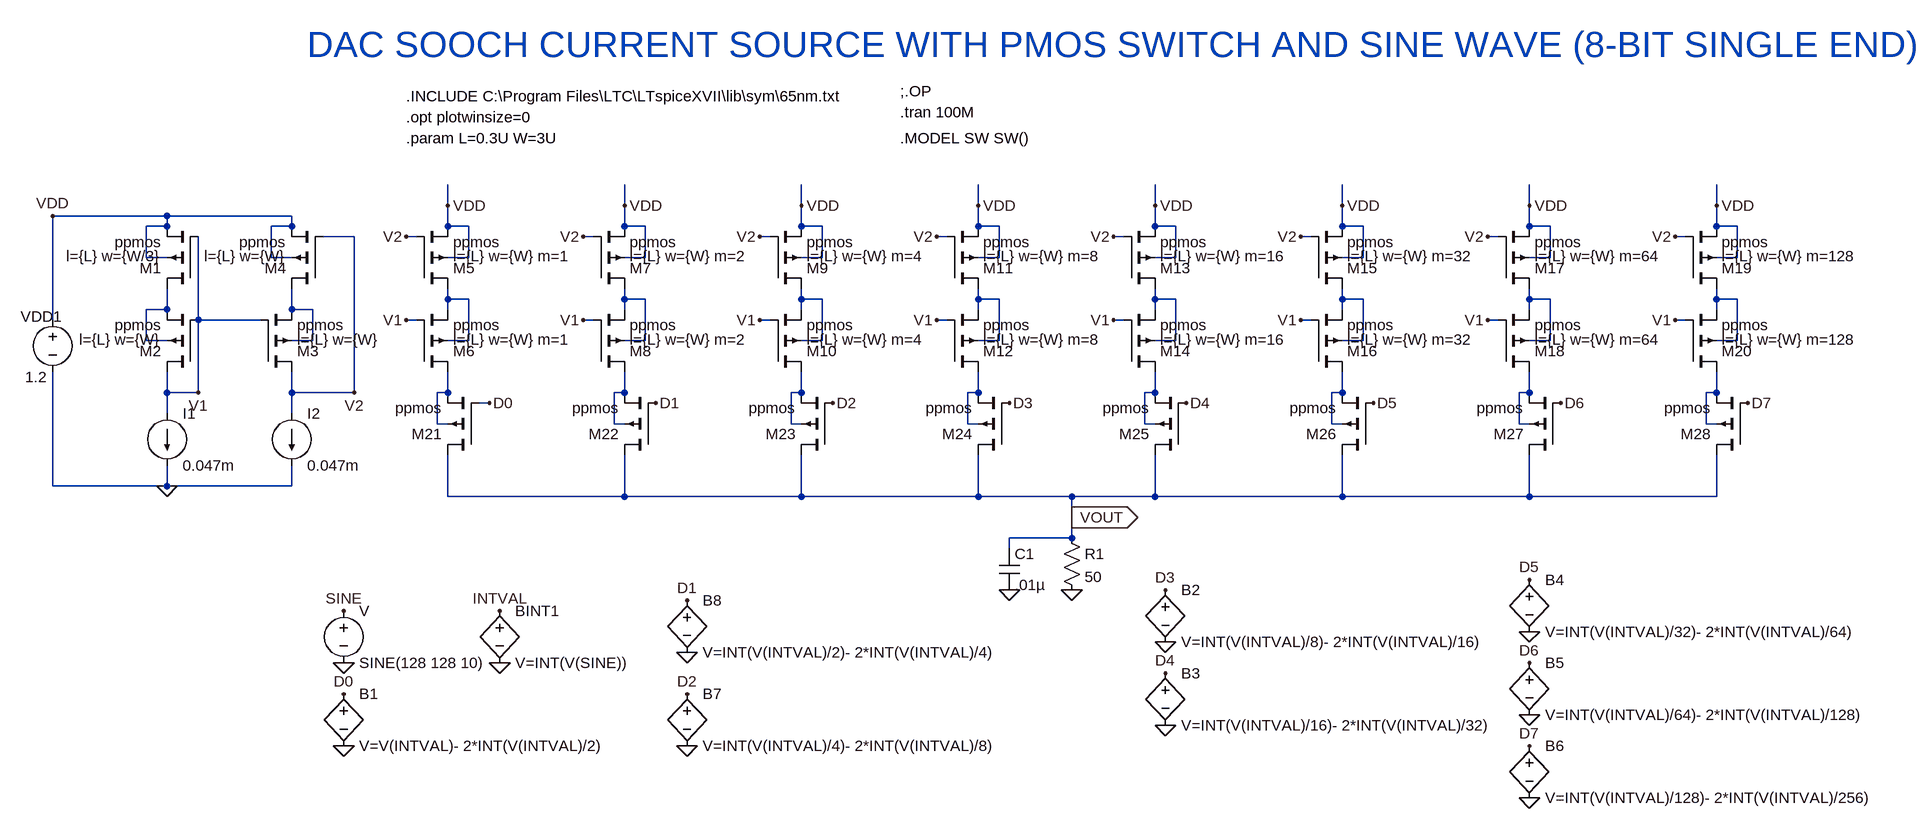
[diagram p0: schematic 108DAC_SINGLE_END_SOOCH_PMOS_SW_SINE_8BIT.asc]
108DAC_SINGLE_END_SOOCH_PMOS_SW_SINE_8BIT.asc, the LTspice schematic file:
Version 4
SHEET 1 1572 880
WIRE -592 -208 -592 -240
WIRE -320 -208 -320 -240
WIRE -48 -208 -48 -240
WIRE 224 -208 224 -240
WIRE 496 -208 496 -240
WIRE 784 -208 784 -240
WIRE 1072 -208 1072 -240
WIRE 1360 -208 1360 -240
WIRE -1024 -192 -1200 -192
WIRE -832 -192 -1024 -192
WIRE -1024 -176 -1024 -192
WIRE -1024 -176 -1056 -176
WIRE -832 -176 -832 -192
WIRE -832 -176 -864 -176
WIRE -592 -176 -592 -208
WIRE -560 -176 -592 -176
WIRE -320 -176 -320 -208
WIRE -288 -176 -320 -176
WIRE -48 -176 -48 -208
WIRE -16 -176 -48 -176
WIRE 224 -176 224 -208
WIRE 256 -176 224 -176
WIRE 496 -176 496 -208
WIRE 528 -176 496 -176
WIRE 784 -176 784 -208
WIRE 816 -176 784 -176
WIRE 1072 -176 1072 -208
WIRE 1104 -176 1072 -176
WIRE 1360 -176 1360 -208
WIRE 1392 -176 1360 -176
WIRE -736 -160 -784 -160
WIRE -640 -160 -656 -160
WIRE -368 -160 -384 -160
WIRE -96 -160 -112 -160
WIRE 176 -160 160 -160
WIRE 448 -160 432 -160
WIRE 736 -160 720 -160
WIRE 1024 -160 1008 -160
WIRE 1312 -160 1296 -160
WIRE -1056 -128 -1056 -176
WIRE -1024 -128 -1056 -128
WIRE -864 -128 -864 -176
WIRE -832 -128 -864 -128
WIRE -560 -128 -560 -176
WIRE -560 -128 -592 -128
WIRE -288 -128 -288 -176
WIRE -288 -128 -320 -128
WIRE -16 -128 -16 -176
WIRE -16 -128 -48 -128
WIRE 256 -128 256 -176
WIRE 256 -128 224 -128
WIRE 528 -128 528 -176
WIRE 528 -128 496 -128
WIRE 816 -128 816 -176
WIRE 816 -128 784 -128
WIRE 1104 -128 1104 -176
WIRE 1104 -128 1072 -128
WIRE 1392 -128 1392 -176
WIRE 1392 -128 1360 -128
WIRE -592 -64 -592 -80
WIRE -560 -64 -592 -64
WIRE -320 -64 -320 -80
WIRE -288 -64 -320 -64
WIRE -48 -64 -48 -80
WIRE -16 -64 -48 -64
WIRE 224 -64 224 -80
WIRE 256 -64 224 -64
WIRE 496 -64 496 -80
WIRE 528 -64 496 -64
WIRE 784 -64 784 -80
WIRE 816 -64 784 -64
WIRE 1072 -64 1072 -80
WIRE 1104 -64 1072 -64
WIRE 1360 -64 1360 -80
WIRE 1392 -64 1360 -64
WIRE -1024 -48 -1024 -80
WIRE -1024 -48 -1056 -48
WIRE -832 -48 -832 -80
WIRE -800 -48 -832 -48
WIRE -592 -48 -592 -64
WIRE -320 -48 -320 -64
WIRE -48 -48 -48 -64
WIRE 224 -48 224 -64
WIRE 496 -48 496 -64
WIRE 784 -48 784 -64
WIRE 1072 -48 1072 -64
WIRE 1360 -48 1360 -64
WIRE -1200 -32 -1200 -192
WIRE -976 -32 -976 -160
WIRE -880 -32 -976 -32
WIRE -640 -32 -656 -32
WIRE -368 -32 -384 -32
WIRE -96 -32 -112 -32
WIRE 176 -32 160 -32
WIRE 448 -32 432 -32
WIRE 736 -32 720 -32
WIRE 1024 -32 1008 -32
WIRE 1312 -32 1296 -32
WIRE -1056 0 -1056 -48
WIRE -1024 0 -1056 0
WIRE -800 0 -800 -48
WIRE -800 0 -832 0
WIRE -560 0 -560 -64
WIRE -560 0 -592 0
WIRE -288 0 -288 -64
WIRE -288 0 -320 0
WIRE -16 0 -16 -64
WIRE -16 0 -48 0
WIRE 256 0 256 -64
WIRE 256 0 224 0
WIRE 528 0 528 -64
WIRE 528 0 496 0
WIRE 816 0 816 -64
WIRE 816 0 784 0
WIRE 1104 0 1104 -64
WIRE 1104 0 1072 0
WIRE 1392 0 1392 -64
WIRE 1392 0 1360 0
WIRE -1024 80 -1024 48
WIRE -976 80 -976 -32
WIRE -976 80 -1024 80
WIRE -832 80 -832 48
WIRE -736 80 -736 -160
WIRE -736 80 -832 80
WIRE -592 80 -592 48
WIRE -592 80 -608 80
WIRE -320 80 -320 48
WIRE -320 80 -336 80
WIRE -48 80 -48 48
WIRE -48 80 -64 80
WIRE 224 80 224 48
WIRE 224 80 208 80
WIRE 496 80 496 48
WIRE 496 80 480 80
WIRE 784 80 784 48
WIRE 784 80 768 80
WIRE 1072 80 1072 48
WIRE 1072 80 1056 80
WIRE 1360 80 1360 48
WIRE 1360 80 1344 80
WIRE -528 96 -544 96
WIRE -1024 112 -1024 80
WIRE -832 112 -832 80
WIRE -608 128 -608 80
WIRE -592 128 -608 128
WIRE -336 128 -336 80
WIRE -320 128 -336 128
WIRE -64 128 -64 80
WIRE -48 128 -64 128
WIRE 208 128 208 80
WIRE 224 128 208 128
WIRE 480 128 480 80
WIRE 496 128 480 128
WIRE 768 128 768 80
WIRE 784 128 768 128
WIRE 1056 128 1056 80
WIRE 1072 128 1056 128
WIRE 1344 128 1344 80
WIRE 1360 128 1344 128
WIRE -1200 224 -1200 48
WIRE -1024 224 -1024 192
WIRE -1024 224 -1200 224
WIRE -832 224 -832 192
WIRE -832 224 -1024 224
WIRE -592 240 -592 176
WIRE -320 240 -320 176
WIRE -320 240 -592 240
WIRE -48 240 -48 176
WIRE -48 240 -320 240
WIRE 224 240 224 176
WIRE 224 240 -48 240
WIRE 368 240 224 240
WIRE 496 240 496 176
WIRE 496 240 368 240
WIRE 784 240 784 176
WIRE 784 240 496 240
WIRE 1072 240 1072 176
WIRE 1072 240 784 240
WIRE 1360 240 1360 176
WIRE 1360 240 1072 240
WIRE 368 272 368 240
WIRE 368 304 368 272
WIRE 368 304 272 304
WIRE 272 320 272 304
FLAG -976 80 V1
FLAG -656 -32 V1
FLAG -736 80 V2
FLAG -656 -160 V2
FLAG -592 -208 VDD
FLAG -1200 -192 VDD
FLAG -384 -32 V1
FLAG -384 -160 V2
FLAG -320 -208 VDD
FLAG -112 -32 V1
FLAG -112 -160 V2
FLAG -48 -208 VDD
FLAG 160 -32 V1
FLAG 160 -160 V2
FLAG 224 -208 VDD
FLAG 432 -32 V1
FLAG 432 -160 V2
FLAG 496 -208 VDD
FLAG 720 -32 V1
FLAG 720 -160 V2
FLAG 784 -208 VDD
FLAG 1008 -32 V1
FLAG 1008 -160 V2
FLAG 1072 -208 VDD
FLAG 1296 -32 V1
FLAG 1296 -160 V2
FLAG 1360 -208 VDD
FLAG 368 384 0
FLAG -1024 224 0
FLAG 368 272 VOUT
IOPIN 368 272 Out
FLAG 272 384 0
FLAG -752 496 0
FLAG -752 416 SINE
FLAG -512 496 0
FLAG -512 416 INTVAL
FLAG -752 544 D0
FLAG -752 624 0
FLAG -224 400 D1
FLAG -224 544 D2
FLAG 512 384 D3
FLAG 512 512 D4
FLAG 1072 368 D5
FLAG 1072 496 D6
FLAG 1072 624 D7
FLAG 512 464 0
FLAG 512 592 0
FLAG 1072 448 0
FLAG 1072 576 0
FLAG 1072 704 0
FLAG -224 624 0
FLAG -224 480 0
FLAG -272 96 D1
FLAG 0 96 D2
FLAG 272 96 D3
FLAG 544 96 D4
FLAG 832 96 D5
FLAG 1120 96 D6
FLAG 1408 96 D7
FLAG -528 96 D0
SYMBOL pmos4 -976 -80 R180
WINDOW 123 56 50 Left 2
SYMATTR Value2 l={L} w={W/3}
SYMATTR InstName M1
SYMATTR Value ppmos
SYMBOL pmos4 -976 48 R180
WINDOW 123 56 50 Left 2
SYMATTR Value2 l={L} w={W}
SYMATTR InstName M2
SYMATTR Value ppmos
SYMBOL current -1024 112 R0
WINDOW 123 0 0 Left 0
WINDOW 39 0 0 Left 0
SYMATTR InstName I1
SYMATTR Value 0.047m
SYMBOL pmos4 -880 48 M180
WINDOW 123 56 50 Left 2
SYMATTR Value2 l={L} w={W}
SYMATTR InstName M3
SYMATTR Value ppmos
SYMBOL pmos4 -784 -80 R180
WINDOW 123 56 50 Left 2
SYMATTR Value2 l={L} w={W}
SYMATTR InstName M4
SYMATTR Value ppmos
SYMBOL current -832 112 R0
WINDOW 123 0 0 Left 0
WINDOW 39 0 0 Left 0
SYMATTR InstName I2
SYMATTR Value 0.047m
SYMBOL pmos4 -640 -80 M180
WINDOW 123 56 50 Left 2
SYMATTR Value2 l={L} w={W} m=1
SYMATTR InstName M5
SYMATTR Value ppmos
SYMBOL pmos4 -640 48 M180
WINDOW 123 56 50 Left 2
SYMATTR Value2 l={L} w={W} m=1
SYMATTR InstName M6
SYMATTR Value ppmos
SYMBOL voltage -1200 -48 R0
WINDOW 123 0 0 Left 0
WINDOW 39 0 0 Left 0
WINDOW 0 -49 11 Left 2
WINDOW 3 -42 104 Left 2
SYMATTR InstName VDD1
SYMATTR Value 1.2
SYMBOL pmos4 -368 -80 M180
WINDOW 123 56 50 Left 2
SYMATTR Value2 l={L} w={W} m=2
SYMATTR InstName M7
SYMATTR Value ppmos
SYMBOL pmos4 -368 48 M180
WINDOW 123 56 50 Left 2
SYMATTR Value2 l={L} w={W} m=2
SYMATTR InstName M8
SYMATTR Value ppmos
SYMBOL pmos4 -96 -80 M180
WINDOW 123 56 50 Left 2
SYMATTR Value2 l={L} w={W} m=4
SYMATTR InstName M9
SYMATTR Value ppmos
SYMBOL pmos4 -96 48 M180
WINDOW 123 56 50 Left 2
SYMATTR Value2 l={L} w={W} m=4
SYMATTR InstName M10
SYMATTR Value ppmos
SYMBOL pmos4 176 -80 M180
WINDOW 123 56 50 Left 2
SYMATTR Value2 l={L} w={W} m=8
SYMATTR InstName M11
SYMATTR Value ppmos
SYMBOL pmos4 176 48 M180
WINDOW 123 56 50 Left 2
SYMATTR Value2 l={L} w={W} m=8
SYMATTR InstName M12
SYMATTR Value ppmos
SYMBOL pmos4 448 -80 M180
WINDOW 123 56 50 Left 2
SYMATTR Value2 l={L} w={W} m=16
SYMATTR InstName M13
SYMATTR Value ppmos
SYMBOL pmos4 448 48 M180
WINDOW 123 56 50 Left 2
SYMATTR Value2 l={L} w={W} m=16
SYMATTR InstName M14
SYMATTR Value ppmos
SYMBOL pmos4 736 -80 M180
WINDOW 123 56 50 Left 2
SYMATTR Value2 l={L} w={W} m=32
SYMATTR InstName M15
SYMATTR Value ppmos
SYMBOL pmos4 736 48 M180
WINDOW 123 56 50 Left 2
SYMATTR Value2 l={L} w={W} m=32
SYMATTR InstName M16
SYMATTR Value ppmos
SYMBOL pmos4 1024 -80 M180
WINDOW 123 56 50 Left 2
SYMATTR Value2 l={L} w={W} m=64
SYMATTR InstName M17
SYMATTR Value ppmos
SYMBOL pmos4 1024 48 M180
WINDOW 123 56 50 Left 2
SYMATTR Value2 l={L} w={W} m=64
SYMATTR InstName M18
SYMATTR Value ppmos
SYMBOL pmos4 1312 -80 M180
WINDOW 123 56 50 Left 2
SYMATTR Value2 l={L} w={W} m=128
SYMATTR InstName M19
SYMATTR Value ppmos
SYMBOL pmos4 1312 48 M180
WINDOW 123 56 50 Left 2
SYMATTR Value2 l={L} w={W} m=128
SYMATTR InstName M20
SYMATTR Value ppmos
SYMBOL res 352 288 R0
SYMATTR InstName R1
SYMATTR Value 50
SYMBOL cap 256 320 R0
SYMATTR InstName C1
SYMATTR Value .01µ
SYMBOL voltage -752 400 R0
WINDOW 123 0 0 Left 0
WINDOW 39 0 0 Left 0
SYMATTR InstName V
SYMATTR Value SINE(128 128 10)
SYMBOL bv -512 400 R0
SYMATTR InstName BINT1
SYMATTR Value V=INT(V(SINE))
SYMBOL bv -752 528 R0
SYMATTR InstName B1
SYMATTR Value V=V(INTVAL)- 2*INT(V(INTVAL)/2)
SYMBOL bv 512 368 R0
SYMATTR InstName B2
SYMATTR Value V=INT(V(INTVAL)/8)- 2*INT(V(INTVAL)/16)
SYMBOL bv 512 496 R0
SYMATTR InstName B3
SYMATTR Value V=INT(V(INTVAL)/16)- 2*INT(V(INTVAL)/32)
SYMBOL bv 1072 352 R0
SYMATTR InstName B4
SYMATTR Value V=INT(V(INTVAL)/32)- 2*INT(V(INTVAL)/64)
SYMBOL bv 1072 480 R0
SYMATTR InstName B5
SYMATTR Value V=INT(V(INTVAL)/64)- 2*INT(V(INTVAL)/128)
SYMBOL bv 1072 608 R0
SYMATTR InstName B6
SYMATTR Value V=INT(V(INTVAL)/128)- 2*INT(V(INTVAL)/256)
SYMBOL bv -224 528 R0
SYMATTR InstName B7
SYMATTR Value V=INT(V(INTVAL)/4)- 2*INT(V(INTVAL)/8)
SYMBOL bv -224 384 R0
SYMATTR InstName B8
SYMATTR Value V=INT(V(INTVAL)/2)- 2*INT(V(INTVAL)/4)
SYMBOL pmos4 -544 176 R180
SYMATTR Value2 l={L} w={W} m=1
SYMATTR InstName M21
SYMATTR Value ppmos
SYMBOL pmos4 -272 176 R180
SYMATTR Value2 l={L} w={W} m=2
SYMATTR InstName M22
SYMATTR Value ppmos
SYMBOL pmos4 0 176 R180
SYMATTR Value2 l={L} w={W} m=4
SYMATTR InstName M23
SYMATTR Value ppmos
SYMBOL pmos4 272 176 R180
SYMATTR Value2 l={L} w={W} m=8
SYMATTR InstName M24
SYMATTR Value ppmos
SYMBOL pmos4 544 176 R180
SYMATTR Value2 l={L} w={W} m=16
SYMATTR InstName M25
SYMATTR Value ppmos
SYMBOL pmos4 832 176 R180
SYMATTR Value2 l={L} w={W} m=32
SYMATTR InstName M26
SYMATTR Value ppmos
SYMBOL pmos4 1120 176 R180
SYMATTR Value2 l={L} w={W} m=64
SYMATTR InstName M27
SYMATTR Value ppmos
SYMBOL pmos4 1408 176 R180
SYMATTR Value2 l={L} w={W} m=128
SYMATTR InstName M28
SYMATTR Value ppmos
TEXT -656 -376 Left 2 !.INCLUDE C:\\Program Files\\LTC\\LTspiceXVII\\lib\\sym\\65nm.txt
TEXT -656 -344 Left 2 !.opt plotwinsize=0
TEXT 104 -384 Left 2 !;.OP
TEXT -656 -312 Left 2 !.param L=0.3U W=3U
TEXT 104 -352 Left 2 !.tran 100M
TEXT 104 -312 Left 2 !.MODEL SW SW()
TEXT -808 -456 Left 5 ;DAC SOOCH CURRENT SOURCE WITH PMOS SWITCH AND SINE WAVE (8-BIT SINGLE END)

The netlist it stands for:
* 108DAC_SINGLE_END_SOOCH_PMOS_SW_SINE_8BIT.asc
M1 N009 V1 VDD VDD ppmos l={L} w={W/3}
M2 V1 V1 N009 N009 ppmos l={L} w={W}
I1 V1 0 0.047m
M3 V2 V1 N010 N010 ppmos l={L} w={W}
M4 N010 V2 VDD VDD ppmos l={L} w={W}
I2 V2 0 0.047m
M5 N001 V2 VDD VDD ppmos l={L} w={W} m=1
M6 N011 V1 N001 N001 ppmos l={L} w={W} m=1
VDD1 VDD 0 1.2
M7 N002 V2 VDD VDD ppmos l={L} w={W} m=2
M8 N012 V1 N002 N002 ppmos l={L} w={W} m=2
M9 N003 V2 VDD VDD ppmos l={L} w={W} m=4
M10 N013 V1 N003 N003 ppmos l={L} w={W} m=4
M11 N004 V2 VDD VDD ppmos l={L} w={W} m=8
M12 N014 V1 N004 N004 ppmos l={L} w={W} m=8
M13 N005 V2 VDD VDD ppmos l={L} w={W} m=16
M14 N015 V1 N005 N005 ppmos l={L} w={W} m=16
M15 N006 V2 VDD VDD ppmos l={L} w={W} m=32
M16 N016 V1 N006 N006 ppmos l={L} w={W} m=32
M17 N007 V2 VDD VDD ppmos l={L} w={W} m=64
M18 N017 V1 N007 N007 ppmos l={L} w={W} m=64
M19 N008 V2 VDD VDD ppmos l={L} w={W} m=128
M20 N018 V1 N008 N008 ppmos l={L} w={W} m=128
R1 VOUT 0 50
C1 VOUT 0 .01µ
V SINE 0 SINE(128 128 10)
BINT1 INTVAL 0 V=INT(V(SINE))
B1 D0 0 V=V(INTVAL)- 2*INT(V(INTVAL)/2)
B2 D3 0 V=INT(V(INTVAL)/8)- 2*INT(V(INTVAL)/16)
B3 D4 0 V=INT(V(INTVAL)/16)- 2*INT(V(INTVAL)/32)
B4 D5 0 V=INT(V(INTVAL)/32)- 2*INT(V(INTVAL)/64)
B5 D6 0 V=INT(V(INTVAL)/64)- 2*INT(V(INTVAL)/128)
B6 D7 0 V=INT(V(INTVAL)/128)- 2*INT(V(INTVAL)/256)
B7 D2 0 V=INT(V(INTVAL)/4)- 2*INT(V(INTVAL)/8)
B8 D1 0 V=INT(V(INTVAL)/2)- 2*INT(V(INTVAL)/4)
M21 VOUT D0 N011 N011 ppmos l={L} w={W} m=1
M22 VOUT D1 N012 N012 ppmos l={L} w={W} m=2
M23 VOUT D2 N013 N013 ppmos l={L} w={W} m=4
M24 VOUT D3 N014 N014 ppmos l={L} w={W} m=8
M25 VOUT D4 N015 N015 ppmos l={L} w={W} m=16
M26 VOUT D5 N016 N016 ppmos l={L} w={W} m=32
M27 VOUT D6 N017 N017 ppmos l={L} w={W} m=64
M28 VOUT D7 N018 N018 ppmos l={L} w={W} m=128
.model NMOS NMOS
.model PMOS PMOS
.lib standard.mos
.INCLUDE C:\Program Files\LTC\LTspiceXVII\lib\sym\65nm.txt
.opt plotwinsize=0
;.OP
.param L=0.3U W=3U
.tran 100M
.MODEL SW SW()
* DAC SOOCH CURRENT SOURCE WITH PMOS SWITCH AND SINE WAVE (8-BIT SINGLE END)
.backanno
.end